# EAGLE design TFT-Display (EAGLE 7.5.0)
QVGA TFT Display With 4 channel switch debouncer and encoder conditioning

## Sheet 1 of 2
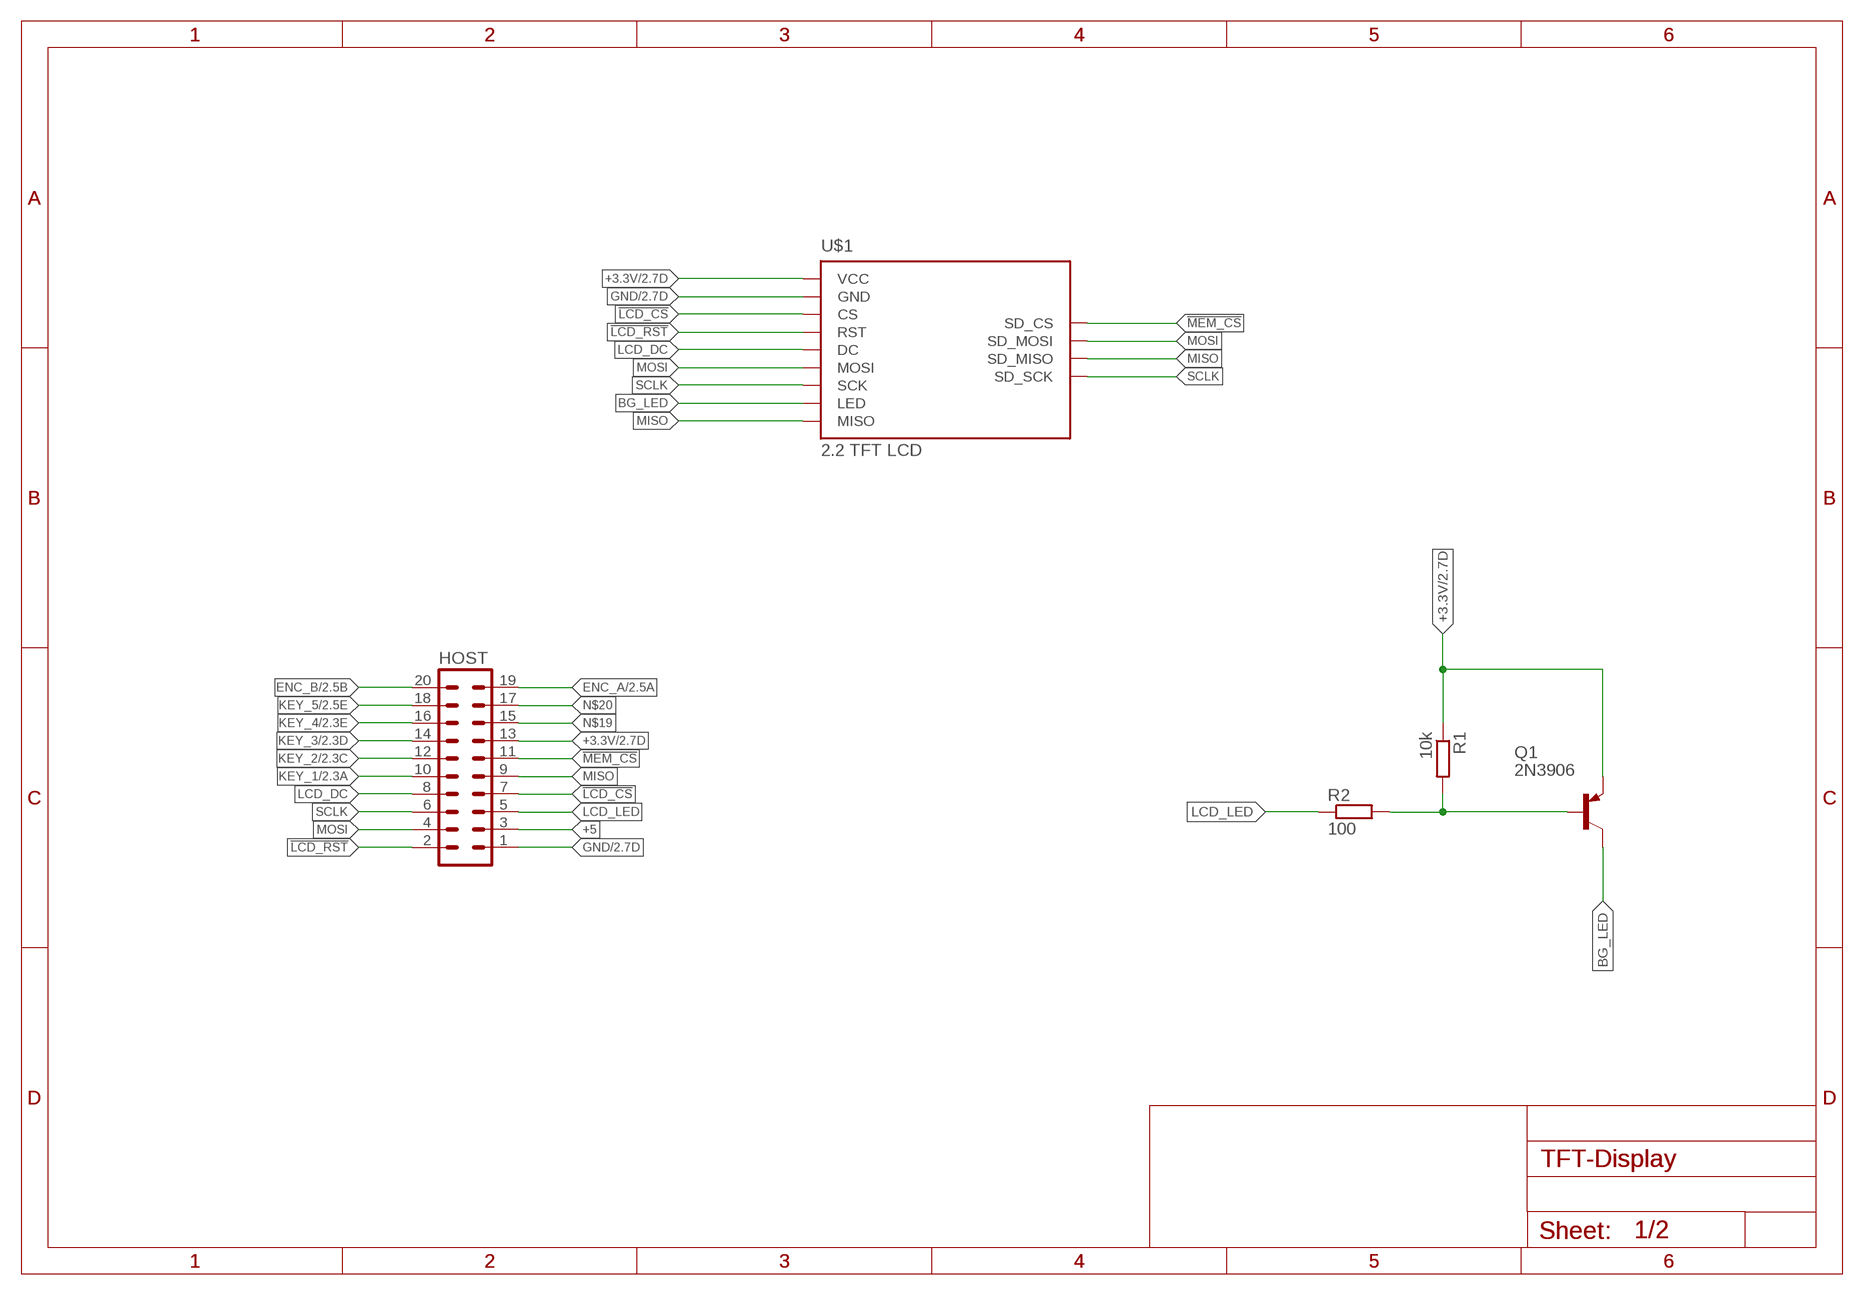
[diagram p0: schematic, sheet 1]

### Parts
HOST  ML20L  [ML20L]
Q1  2N3906  [TO92]
R1  10k  R-EU_0204/7  [0204/7]
R2  100  R-EU_0204/7  [0204/7]
U$1  2.2_TFT_LCDNEW  [2.2_TFT_LCD_LEDSEE]

### Nets
!LCD_CS: HOST.7 U$1.P$3_CS(CS)
!LCD_RST: HOST.2 U$1.P$2_RESET(RST)
!MEM_CS: HOST.11 U$1.P$2_SD_CS(SD_CS)
+3.3V [Supply]: HOST.13 Q1.3(E) R1.1 U$1.P$5_VCC(VCC) ; also sheet 2
+5 [Supply]: HOST.3
BG_LED: Q1.1(C) U$1.P$8_LED(LED)
ENC_A: HOST.19 ; also sheet 2
ENC_B: HOST.20 ; also sheet 2
GND [Supply]: HOST.1 U$1.P$4_GND(GND) ; also sheet 2
KEY_1: HOST.10 ; also sheet 2
KEY_2: HOST.12 ; also sheet 2
KEY_3: HOST.14 ; also sheet 2
KEY_4: HOST.16 ; also sheet 2
KEY_5: HOST.18 ; also sheet 2
LCD_DC: HOST.8 U$1.P$1_DC(DC)
LCD_LED: HOST.5 R2.1
MISO: HOST.9 U$1.P$3_SD_MISO(SD_MISO) U$1.P$9_MISO(MISO)
MOSI: HOST.4 U$1.P$1_SD_MOSI(SD_MOSI) U$1.P$6_MOSI(MOSI)
N$2: Q1.2(B) R1.2 R2.2
N$19: HOST.15
N$20: HOST.17
SCLK: HOST.6 U$1.P$4_SD_SCK(SD_SCK) U$1.P$7_SCK(SCK)

## Sheet 2 of 2: Debouncer Simple RC Schmitt-Trigger debouncer
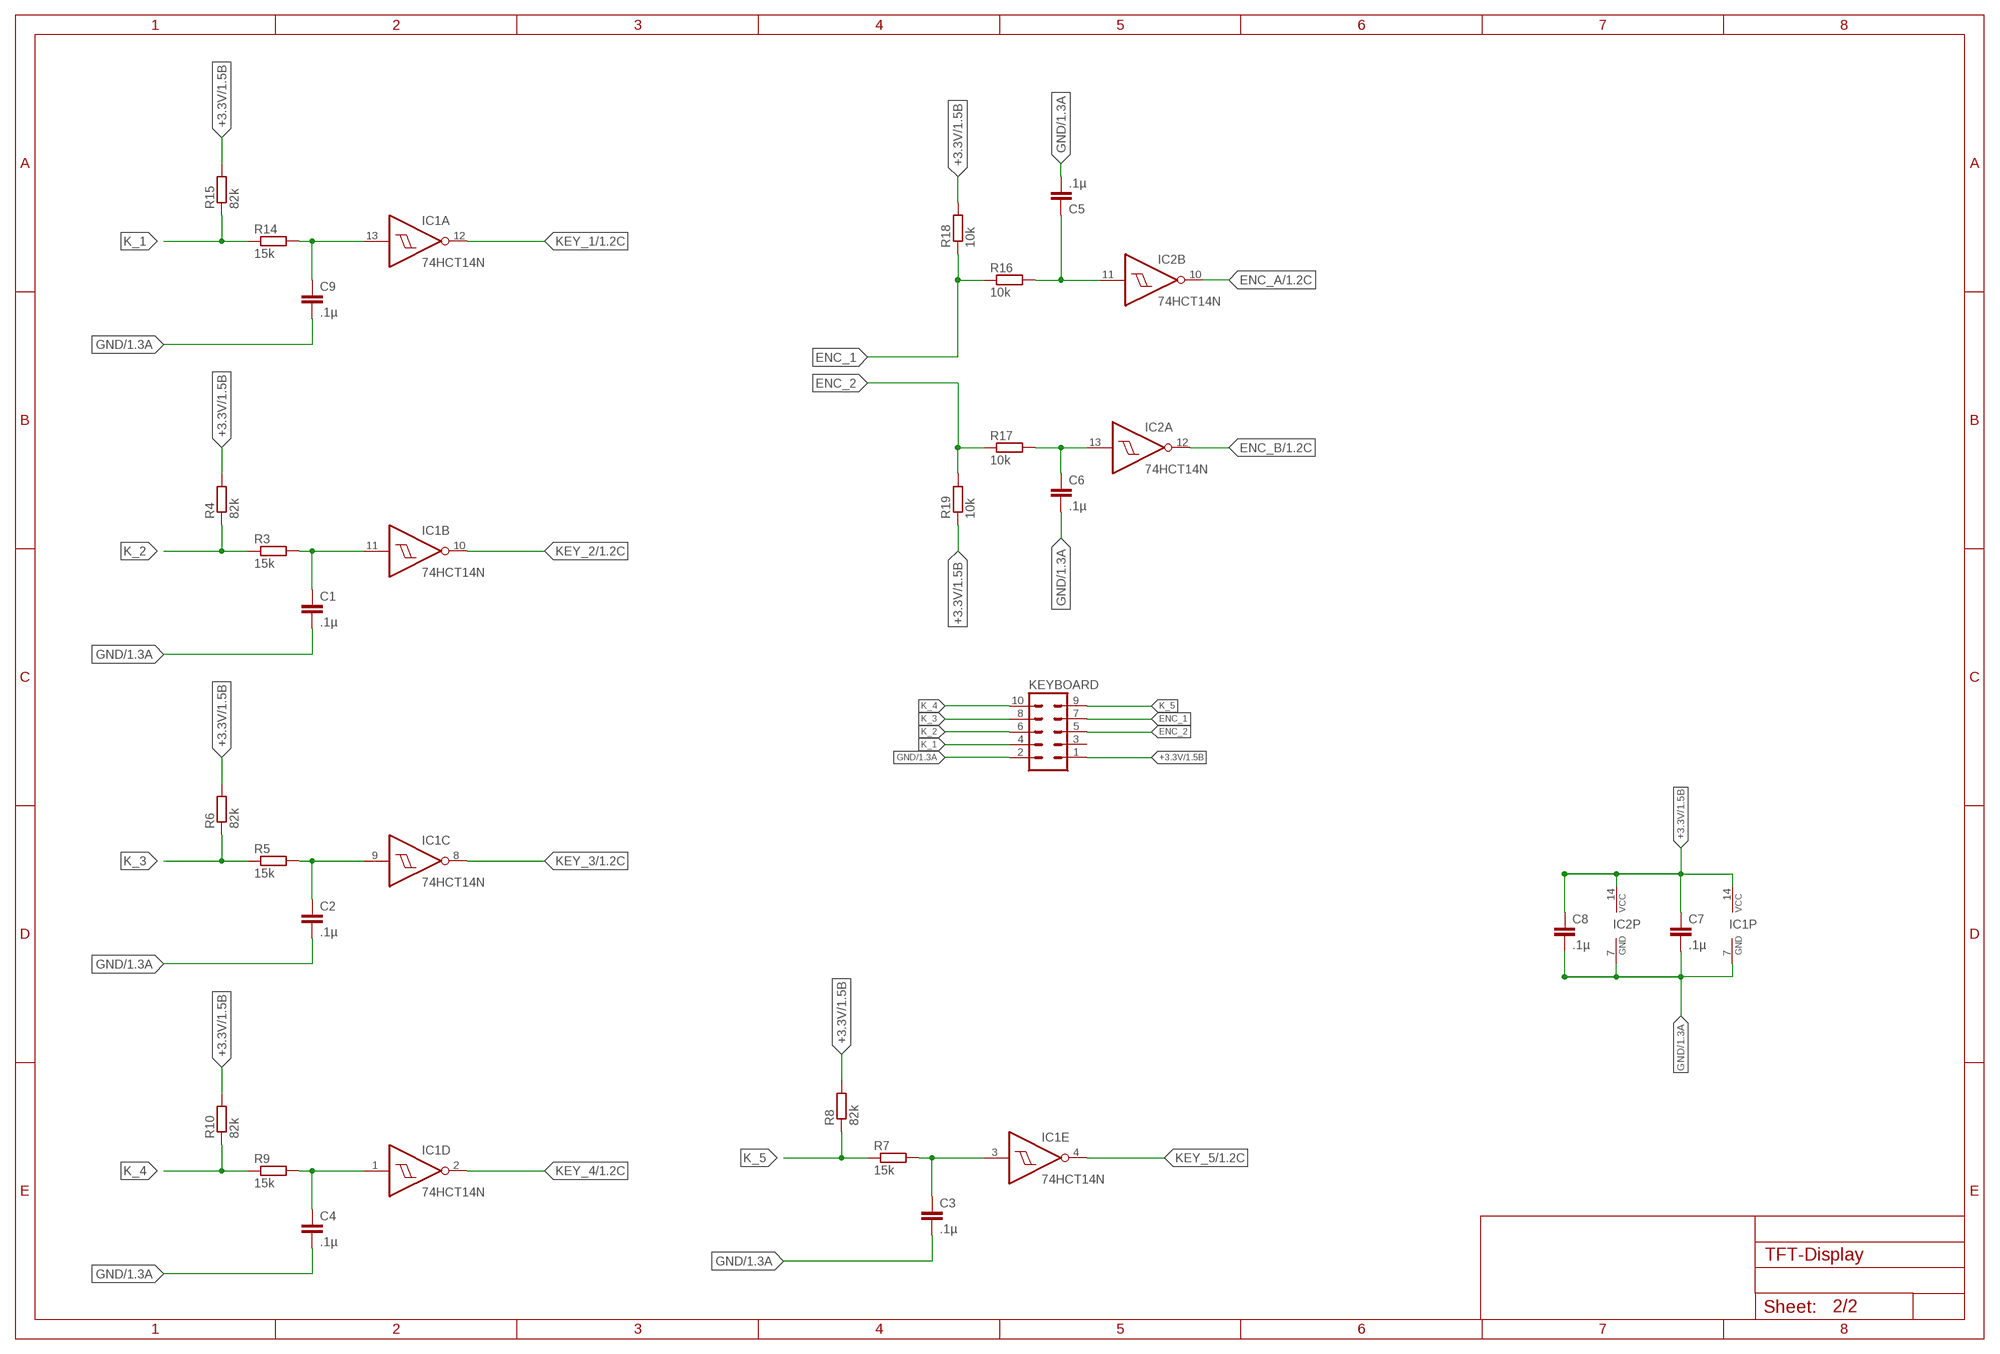
[diagram p1: schematic, sheet 2]

### Parts
C1  .1µ  C-EU025-024X044  [C025-024X044]
C2  .1µ  C-EU025-024X044  [C025-024X044]
C3  .1µ  C-EU025-024X044  [C025-024X044]
C4  .1µ  C-EU025-024X044  [C025-024X044]
C5  .1µ  C-EU025-024X044  [C025-024X044]
C6  .1µ  C-EU025-024X044  [C025-024X044]
C7  .1µ  C-EU025-024X044  [C025-024X044]
C8  .1µ  C-EU025-024X044  [C025-024X044]
C9  .1µ  C-EU025-024X044  [C025-024X044]
IC1  74HCT14N  [DIL14]
IC2  74HCT14N  [DIL14]
KEYBOARD  ML10L  [ML10L]
R3  15k  R-EU_0204/7  [0204/7]
R4  82k  R-EU_0204/7  [0204/7]
R5  15k  R-EU_0204/7  [0204/7]
R6  82k  R-EU_0204/7  [0204/7]
R7  15k  R-EU_0204/7  [0204/7]
R8  82k  R-EU_0204/7  [0204/7]
R9  15k  R-EU_0204/7  [0204/7]
R10  82k  R-EU_0204/7  [0204/7]
R14  15k  R-EU_0204/7  [0204/7]
R15  82k  R-EU_0204/7  [0204/7]
R16  10k  R-EU_0204/7  [0204/7]
R17  10k  R-EU_0204/7  [0204/7]
R18  10k  R-EU_0204/7  [0204/7]
R19  10k  R-EU_0204/7  [0204/7]

### Nets
+3.3V [Supply]: C7.1 C8.1 IC1.14(P:VCC) IC2.14(P:VCC) KEYBOARD.1 R4.2 R6.2 R8.2 R10.2 R15.2 R18.2 R19.1 ; also sheet 1
ENC1: C5.1 IC2.11(B:I) R16.2
ENC2: C6.1 IC2.13(A:I) R17.2
ENC_1: KEYBOARD.7 R16.1 R18.1
ENC_2: KEYBOARD.5 R17.1 R19.2
ENC_A: IC2.10(B:O) ; also sheet 1
ENC_B: IC2.12(A:O) ; also sheet 1
GND [Supply]: C1.2 C2.2 C3.2 C4.2 C5.2 C6.2 C7.2 C8.2 C9.2 IC1.7(P:GND) IC2.7(P:GND) KEYBOARD.2 ; also sheet 1
K1: C9.1 IC1.13(A:I) R14.2
K2: C1.1 IC1.11(B:I) R3.2
K3: C2.1 IC1.9(C:I) R5.2
K4: C3.1 IC1.3(E:I) R7.2
K5: C4.1 IC1.1(D:I) R9.2
K_1: KEYBOARD.4 R14.1 R15.1
K_2: KEYBOARD.6 R3.1 R4.1
K_3: KEYBOARD.8 R5.1 R6.1
K_4: KEYBOARD.10 R9.1 R10.1
K_5: KEYBOARD.9 R7.1 R8.1
KEY_1: IC1.12(A:O) ; also sheet 1
KEY_2: IC1.10(B:O) ; also sheet 1
KEY_3: IC1.8(C:O) ; also sheet 1
KEY_4: IC1.2(D:O) ; also sheet 1
KEY_5: IC1.4(E:O) ; also sheet 1
Unconnected: IC1.5(F:I) IC1.6(F:O) IC2.1(D:I) IC2.2(D:O) IC2.3(E:I) IC2.4(E:O) IC2.5(F:I) IC2.6(F:O) IC2.8(C:O) IC2.9(C:I) KEYBOARD.3

## Library data of the parts
C1-C9 = rcl:C-EU: CAPACITOR, European symbol
HOST = con-harting-ml:ML20: HARTING; OC_FARNELL: unknown; OC_NEWARK: unknown
IC1 IC2 = 74xx-eu:74*14: Hex schmitt trigger INVERTER
KEYBOARD = con-harting-ml:ML10: HARTING; OC_FARNELL: unknown; OC_NEWARK: unknown
Q1 = transistor-pnp:2N3906: PNP Transistor
R1-R10 R14-R19 = resistor:R-EU_: RESISTOR, European symbol
U$1 = 2.2"tft:2.2_TFT_LCD

## Net classes
0 default: width 0.203 mm, drill 0.305 mm
1 Supply: width 0.406 mm, drill 0.305 mm

## Board
QVGA TFT Display board
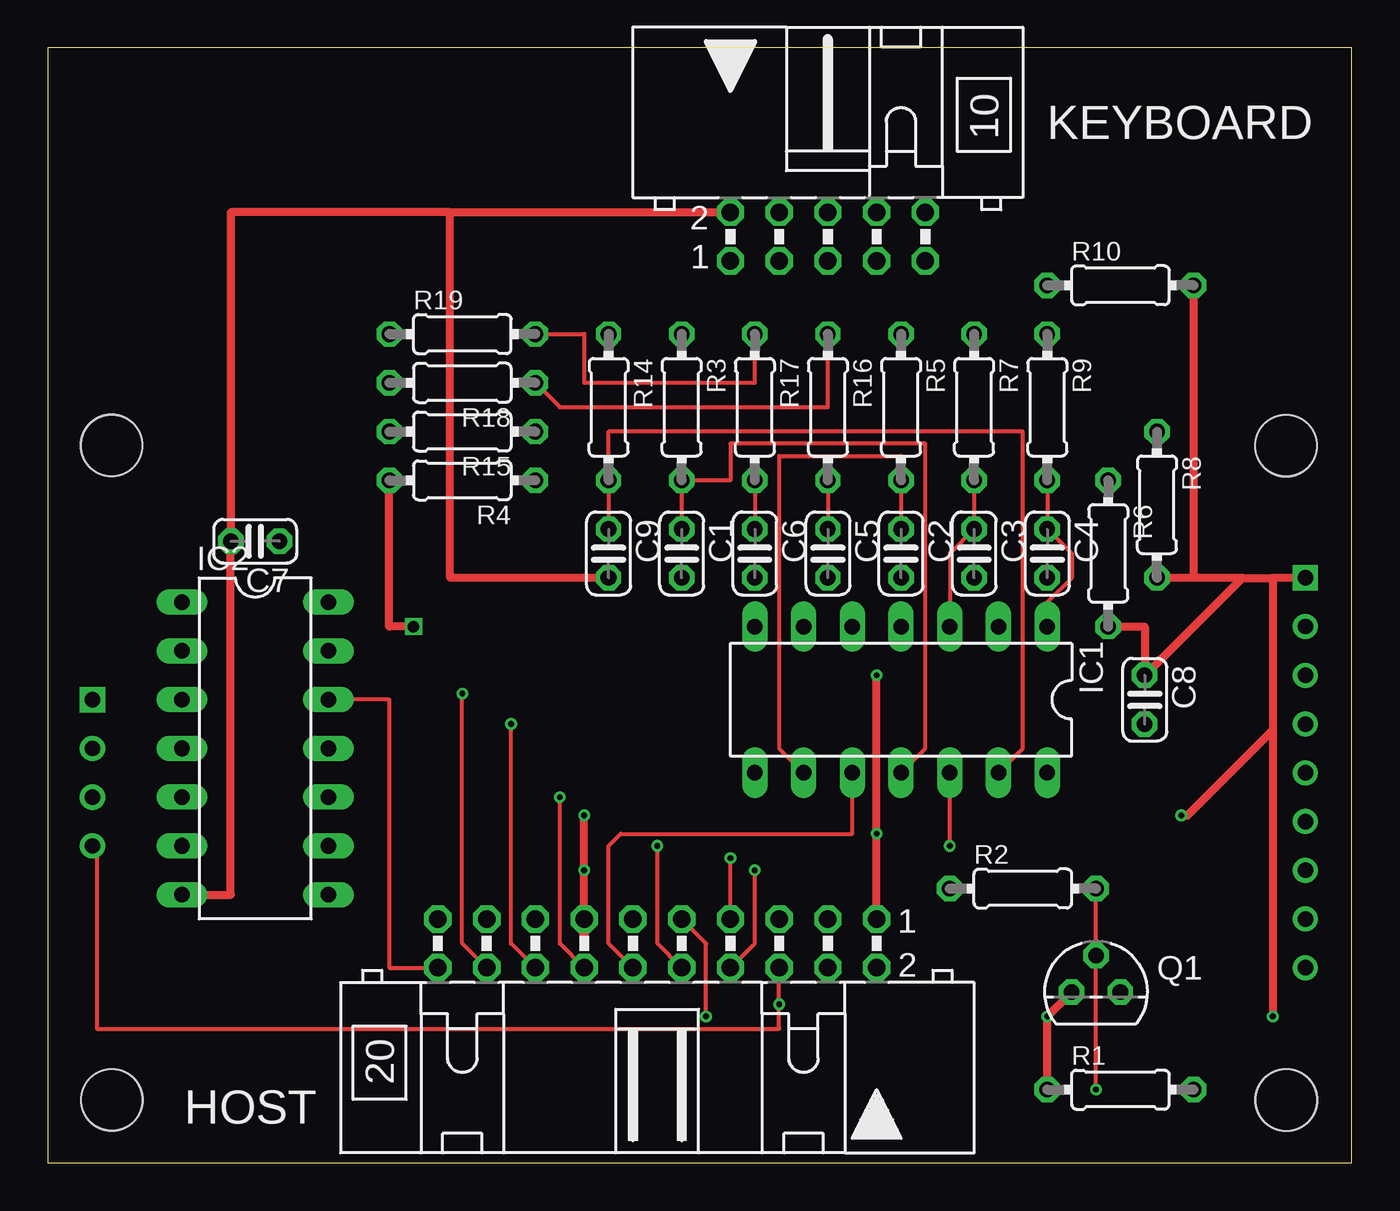
[diagram p2: board, top side]
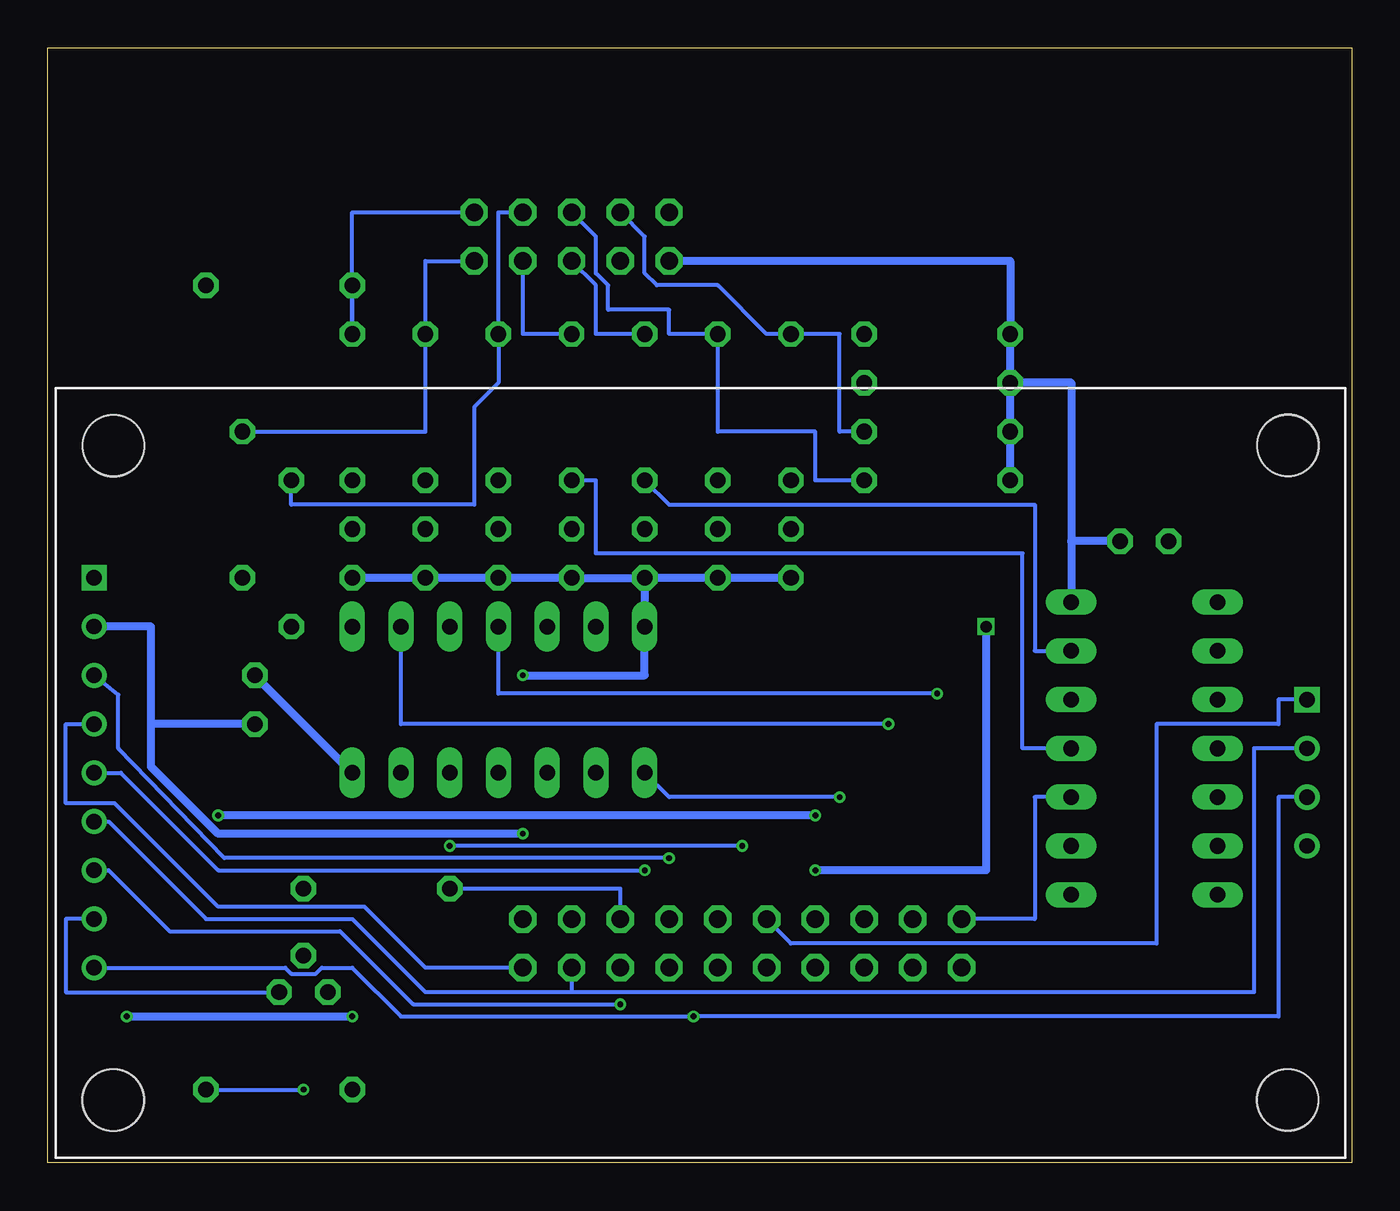
[diagram p3: board, bottom side, seen from below]

Size 67.92 x 58.09 mm. Coordinates in mm from the lower left corner, seen from the top.
Outline: 0,0 67.92,0 67.92,58.09 0,58.09 0,0
Copper layers (1*16): Top 0.035mm / dielectric 1.5mm / Bottom 0.035mm
Design rules "dirt_cheap_dirty_boards.v1": minimum track width 5mil, minimum drill 12mil, track to track 5mil, track to pad 5mil, pad to pad 5mil, via to via 5mil, smd to smd 0mil, copper to edge 10mil, drill to drill 10mil, minimum pad ring 10mil, minimum via ring 6mil, stop-mask expansion 2mil, vias tented up to drill 25mil, thermal gap 10mil
Holes 3.2 mm at 64.52,37.37 64.53,3.27 3.34,3.28 3.32,37.38

### Footprints (pad centres in the part's own frame; a part is rotated, then mirrored left to right if it is on the bottom)
C025-024X044 = drill 0.813 octagon: 1 -1.27,0; 2 1.27,0
ML20L = drill 0.914 octagon: 1 -11.43,-1.27; 2 -11.43,1.27; 3 -8.89,-1.27; 4 -8.89,1.27; 5 -6.35,-1.27; 6 -6.35,1.27; 7 -3.81,-1.27; 8 -3.81,1.27; 9 -1.27,-1.27; 10 -1.27,1.27; 11 1.27,-1.27; 12 1.27,1.27; 13 3.81,-1.27; 14 3.81,1.27; 15 6.35,-1.27; 16 6.35,1.27; 17 8.89,-1.27; 18 8.89,1.27; 19 11.43,-1.27; 20 11.43,1.27
DIL14 = drill 0.813 long: 1 -7.62,-3.81; 2 -5.08,-3.81; 3 -2.54,-3.81; 4 0,-3.81; 5 2.54,-3.81; 6 5.08,-3.81; 7 7.62,-3.81; 8 7.62,3.81; 9 5.08,3.81; 10 2.54,3.81; 11 0,3.81; 12 -2.54,3.81; 13 -5.08,3.81; 14 -7.62,3.81
ML10L = drill 0.914 octagon: 1 -5.08,-1.27; 2 -5.08,1.27; 3 -2.54,-1.27; 4 -2.54,1.27; 5 0,-1.27; 6 0,1.27; 7 2.54,-1.27; 8 2.54,1.27; 9 5.08,-1.27; 10 5.08,1.27
TO92 = drill 0.813 octagon: 1 1.27,0; 2 0,1.905; 3 -1.27,0
0204/7 = drill 0.813 octagon: 1 -3.81,0; 2 3.81,0
2.2_TFT_LCD_LEDSEE = drill 0.8: P$1_DC -31.6,0; P$1_SD_MOSI 31.6,1.27; P$2_RESET -31.6,2.54; P$3_CS -31.6,5.08; P$3_SD_MISO 31.6,-1.27; P$4_GND -31.6,7.62; P$4_SD_SCK 31.6,-3.81; P$6_MOSI -31.6,-2.54; P$7_SCK -31.6,-5.08; P$8_LED -31.6,-7.62; P$9_MISO -31.6,-10.16 | drill 0.8 square: P$2_SD_CS 31.6,3.81; P$5_VCC -31.6,10.16 | hole 3.2: -30.6,17.05; 30.6,17.05; 30.6,-17.05; -30.6,-17.05

### Placement (x,y rotation side)
C1  33.02,31.75 270 top
C2  44.45,31.75 270 top
C3  48.26,31.75 270 top
C4  52.07,31.75 270 top
C5  40.64,31.75 270 top
C6  36.83,31.75 270 top
C7  10.79,32.38 180 top
C8  57.15,24.13 270 top
C9  29.21,31.75 270 top
HOST  31.75,11.43 180 top
IC1  44.45,24.13 180 top
IC2  10.79,21.59 270 top
KEYBOARD  40.64,48.26 0 top
Q1  54.61,8.89 0 top
R1  55.88,3.81 0 top
R2  50.8,14.29 0 top
R3  33.02,39.37 270 top
R4  21.59,35.56 180 top
R5  44.45,39.37 270 top
R6  55.24,31.75 270 top
R7  48.26,39.37 270 top
R8  57.78,34.29 270 top
R9  52.07,39.37 270 top
R10  55.88,45.72 0 top
R14  29.21,39.37 270 top
R15  21.59,38.1 180 top
R16  40.64,39.37 270 top
R17  36.83,39.37 270 top
R18  21.59,40.64 180 top
R19  21.59,43.18 0 top
U$1  33.92,20.32 0 bottom

### Tracks (layer width: path | path; a pad name or v marks a point on that pad's centre or on a via)
!LCD_CS  (via drill 0.3 pad 0.25)
  Top 0.203: HOST.7 v35.56,15.88
  Bottom 0.203: v35.56,15.88 58.74,15.88 64.26,21.59 64.26,24.38 U$1.P$3_CS
!LCD_RST
  Bottom 0.203: HOST.2 48.26,10.16 51.44,13.34 59.05,13.34 64.45,18.73 66.99,18.73 66.99,22.86 U$1.P$2_RESET
!MEM_CS
  Bottom 0.203: U$1.P$2_SD_CS 3.81,24.13 3.81,22.86 10.16,22.86 10.16,11.43 29.21,11.43 HOST.11
+3.3V  (via drill 0.3, 0.3 pad 0.25, 0.6)
  Top 0.406: HOST.13 v27.94,15.24 v27.94,18.1 | R1.1 v52.07,7.62 Q1.3 | U$1.P$5_VCC 63.82,30.48 | 63.82,30.48 63.82,22.54 | 63.82,22.54 v63.82,7.62 | v59.05,18.1 59.37,18.1 63.82,22.54 | 62.23,30.48 C8.1 57.15,27.94 R6.2 | 62.23,30.48 63.82,30.48 | v19.05,27.94 17.78,27.94 R4.2 | R10.2 59.69,30.48 | 59.69,30.48 R8.2 | 62.23,30.48 59.69,30.48
  Top 0.61: HOST.13 27.94,12.06
  Bottom 0.406: v63.82,7.62 v52.07,7.62 | v27.94,18.1 v59.05,18.1 | C8.1 IC1.14 | 14.61,32.38 14.61,40.64 R18.2 | 14.61,32.38 IC2.14 | KEYBOARD.1 17.78,46.99 R19.1 R18.2 | R4.2 R15.2 R18.2 | C7.1 14.61,32.38 | v19.05,27.94 19.05,15.24 v27.94,15.24
BG_LED
  Bottom 0.203: U$1.P$8_LED 66.99,12.7 66.99,8.89 Q1.1
ENC1
  Top 0.203: R16.2 C5.1
  Bottom 0.203: IC2.11 17.14,21.59 17.14,31.75 39.37,31.75 39.37,35.56 R16.2
ENC2
  Top 0.203: R17.2 C6.1
  Bottom 0.203: R17.2 35.56,34.29 16.51,34.29 16.51,26.67 IC2.13
ENC_1
  Top 0.203: R18.1 26.67,39.37 40.64,39.37 R16.1
  Bottom 0.203: R16.1 43.18,43.18 KEYBOARD.7
ENC_2
  Top 0.203: R19.2 27.94,43.18 27.94,40.64 36.83,40.64 R17.1
  Bottom 0.203: R17.1 39.37,43.18 39.37,45.72 KEYBOARD.5
ENC_A
  Bottom 0.203: IC2.10 16.51,19.05 16.51,12.7 HOST.19
ENC_B
  Top 0.203: IC2.12 17.78,24.13 17.78,10.16 HOST.20
GND  (via drill 0.3 pad 0.25, 0.3 pad 0.3)
  Top 0.406: HOST.1 v43.18,17.14 v43.18,25.4 | C9.2 20.95,30.48 20.95,49.53 | 20.95,49.53 KEYBOARD.2 | 20.95,49.53 9.53,49.53 C7.2 9.53,13.97 IC2.7
  Bottom 0.406: v43.18,17.14 59.05,17.14 62.55,20.64 62.55,22.86 | 62.55,22.86 62.55,27.94 U$1.P$4_GND | v43.18,25.4 36.83,25.4 IC1.7 C6.2 | C9.2 C1.2 C6.2 | C4.2 C3.2 C2.2 C5.2 C6.2 | C8.2 62.55,22.86
K1
  Top 0.203: C9.1 R14.2 29.21,38.1 50.8,38.1 50.8,21.59 IC1.13
K2
  Top 0.203: C1.1 R3.2 35.56,35.56 35.56,37.47 45.72,37.47 45.72,21.59 IC1.11
K3
  Top 0.203: C2.1 R5.2 44.45,36.83 38.1,36.83 38.1,21.59 IC1.9
K4
  Top 0.203: R7.2 C3.1 46.99,31.75 IC1.3
K5
  Top 0.203: R9.2 C4.1 53.34,31.75 53.34,30.48 52.07,29.21 IC1.1
K_1
  Bottom 0.203: R15.1 26.67,38.1 26.67,43.18 R14.1 30.48,43.18 33.02,45.72 36.2,45.72 36.83,46.35 36.83,48.26 KEYBOARD.4
K_2
  Bottom 0.203: R4.1 27.94,35.56 27.94,38.1 33.02,38.1 R3.1 35.56,43.18 35.56,44.45 38.73,44.45 38.73,45.72 39.37,46.35 39.37,48.26 KEYBOARD.6
K_3
  Bottom 0.203: KEYBOARD.8 44.45,49.53 R5.1 44.45,40.64 45.72,39.37 45.72,34.29 55.24,34.29 R6.1
K_4
  Bottom 0.203: R10.1 R9.1 52.07,49.53 KEYBOARD.10
K_5
  Bottom 0.203: R8.1 48.26,38.1 R7.1 48.26,46.99 KEYBOARD.9
KEY_1  (via drill 0.3 pad 0.25)
  Top 0.203: HOST.10 31.75,11.43 v31.75,16.51 | v46.99,16.51 IC1.12
  Bottom 0.203: v31.75,16.51 v46.99,16.51
KEY_2
  Top 0.203: HOST.12 29.21,11.43 29.21,16.51 29.84,17.14 41.91,17.14 IC1.10
KEY_3  (via drill 0.3 pad 0.25)
  Top 0.203: HOST.14 26.67,11.43 v26.67,19.05
  Bottom 0.203: v26.67,19.05 35.56,19.05 IC1.8
KEY_4  (via drill 0.3)
  Top 0.203: HOST.16 24.13,11.43 v24.13,22.86
  Bottom 0.203: v24.13,22.86 49.53,22.86 IC1.2
KEY_5  (via drill 0.3 pad 0.51)
  Top 0.203: HOST.18 21.59,11.43 v21.59,24.45
  Bottom 0.203: v21.59,24.45 44.45,24.45 IC1.4
LCD_DC  (via drill 0.3 pad 0.25)
  Top 0.203: HOST.8 36.83,11.43 v36.83,15.24
  Bottom 0.203: U$1.P$1_DC 64.14,20.32 59.05,15.24 v36.83,15.24
LCD_LED
  Bottom 0.203: R2.1 38.1,14.29 HOST.5
MISO  (via drill 0.3 pad 0.25)
  Top 0.203: HOST.9 34.29,11.43 v34.29,7.62
  Bottom 0.203: U$1.P$3_SD_MISO 3.81,19.05 3.81,7.62 v34.29,7.62 49.53,7.62 52.07,10.16 53.66,10.16 53.98,9.84 55.24,9.84 55.56,10.16 U$1.P$9_MISO
MOSI
  Bottom 0.203: U$1.P$1_SD_MOSI 5.08,21.59 5.08,8.89 40.64,8.89 | 40.64,8.89 48.26,8.89 52.07,12.7 59.69,12.7 64.77,17.78 U$1.P$6_MOSI | HOST.4 40.64,8.89
N$2  (via drill 0.3)
  Top 0.203: v54.61,3.81 Q1.2 R2.2
  Bottom 0.203: R1.2 v54.61,3.81
SCLK  (via drill 0.3 pad 0.25)
  Top 0.203: HOST.6 v38.1,8.26 38.1,6.99 2.54,6.99 2.54,16 U$1.P$4_SD_SCK
  Bottom 0.203: U$1.P$7_SCK 64.77,15.24 61.59,12.06 52.7,12.06 48.9,8.26 v38.1,8.26